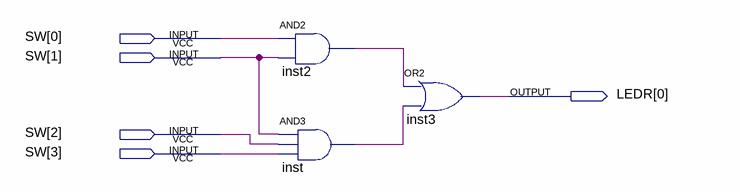
[diagram p0: schematic sheet]
// Quartus schematic pratica1.bdf as structural Verilog: 3 symbols, 5 pins
module pratica1 (
  input  [3:0] SW,
  output [0:0] LEDR
);

  wire inst2_out, inst_out;

  and inst2 (inst2_out, SW[0], SW[1]);
  and inst (inst_out, SW[1], SW[2], SW[3]);
  or inst3 (LEDR[0], inst2_out, inst_out);
endmodule
